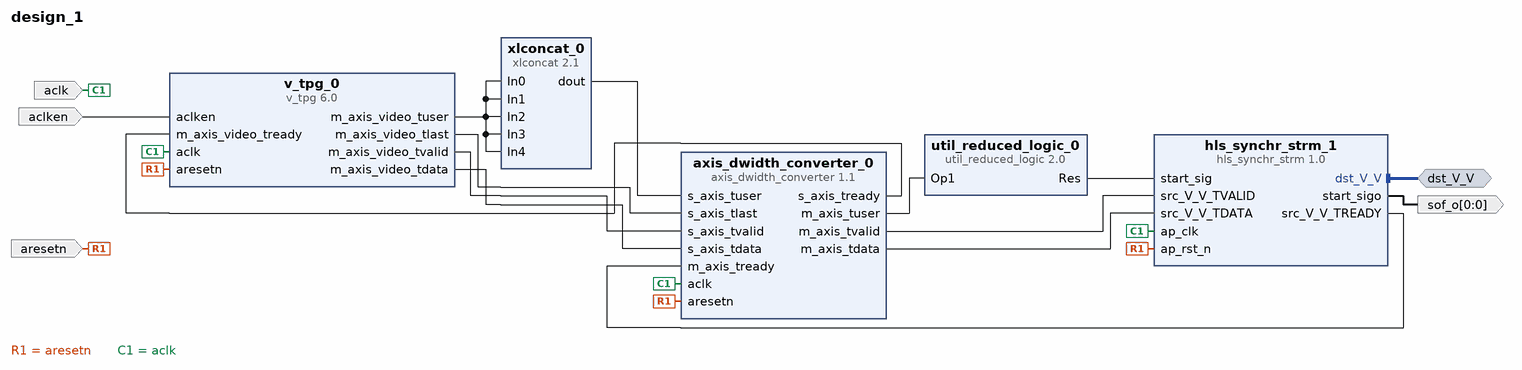
[diagram p0: block diagram of the top level]
# Vivado block design design_1, Vivado 2014.4
create_bd_design design_1

create_bd_intf_port -mode Master -vlnv xilinx.com:interface:axis_rtl:1.0 dst_V_V
set_property -dict {CONFIG.FREQ_HZ 19200000} [get_bd_intf_ports dst_V_V]
create_bd_port -dir I -type rst aresetn
create_bd_port -dir I -type ce aclken
create_bd_port -dir I -type clk aclk
set_property -dict {CONFIG.FREQ_HZ 19200000} [get_bd_ports aclk]
create_bd_port -dir O -from 0 -to 0 -type data sof_o

create_bd_cell -type ip -vlnv xilinx.com:ip:v_tpg:6.0 v_tpg_0
set_property -dict [list \
  CONFIG.has_axi4_lite false \
  CONFIG.data_width 12 \
  CONFIG.pattern_control 15 \
  CONFIG.active_cols 64 \
  CONFIG.active_rows 768 \
  CONFIG.m_video_format 2 \
] [get_bd_cells v_tpg_0]
create_bd_cell -type ip -vlnv xilinx.com:ip:xlconcat:2.1 xlconcat_0
set_property -dict {CONFIG.NUM_PORTS 5} [get_bd_cells xlconcat_0]
create_bd_cell -type ip -vlnv xilinx.com:ip:util_reduced_logic:2.0 util_reduced_logic_0
set_property -dict {CONFIG.C_SIZE 8} [get_bd_cells util_reduced_logic_0]
create_bd_cell -type ip -vlnv xilinx.com:ip:axis_dwidth_converter:1.1 axis_dwidth_converter_0
set_property -dict [list \
  CONFIG.S_TDATA_NUM_BYTES 5 \
  CONFIG.M_TDATA_NUM_BYTES 8 \
  CONFIG.TUSER_BITS_PER_BYTE 1 \
  CONFIG.HAS_TLAST 1 \
  CONFIG.HAS_MI_TKEEP 1 \
] [get_bd_cells axis_dwidth_converter_0]
create_bd_cell -type ip -vlnv xilinx.com:hls:hls_synchr_strm:1.0 hls_synchr_strm_1

# ---- connections ----

connect_bd_intf_net [get_bd_intf_ports dst_V_V] [get_bd_intf_pins hls_synchr_strm_1/dst_V_V]
connect_bd_net [get_bd_ports aresetn] \
  [get_bd_pins v_tpg_0/aresetn] [get_bd_pins axis_dwidth_converter_0/aresetn] [get_bd_pins hls_synchr_strm_1/ap_rst_n]
connect_bd_net [get_bd_ports aclken] [get_bd_pins v_tpg_0/aclken]
connect_bd_net [get_bd_ports aclk] [get_bd_pins v_tpg_0/aclk] [get_bd_pins hls_synchr_strm_1/ap_clk] [get_bd_pins axis_dwidth_converter_0/aclk]
connect_bd_net [get_bd_pins v_tpg_0/m_axis_video_tuser] \
  [get_bd_pins xlconcat_0/In0] [get_bd_pins xlconcat_0/In1] [get_bd_pins xlconcat_0/In2] [get_bd_pins xlconcat_0/In3] \
  [get_bd_pins xlconcat_0/In4]
connect_bd_net [get_bd_pins v_tpg_0/m_axis_video_tlast] [get_bd_pins axis_dwidth_converter_0/s_axis_tlast]
connect_bd_net [get_bd_pins xlconcat_0/dout] [get_bd_pins axis_dwidth_converter_0/s_axis_tuser]
connect_bd_net [get_bd_pins v_tpg_0/m_axis_video_tvalid] [get_bd_pins axis_dwidth_converter_0/s_axis_tvalid]
connect_bd_net [get_bd_pins v_tpg_0/m_axis_video_tdata] [get_bd_pins axis_dwidth_converter_0/s_axis_tdata]
connect_bd_net [get_bd_pins axis_dwidth_converter_0/s_axis_tready] [get_bd_pins v_tpg_0/m_axis_video_tready]
connect_bd_net [get_bd_pins axis_dwidth_converter_0/m_axis_tvalid] [get_bd_pins hls_synchr_strm_1/src_V_V_TVALID]
connect_bd_net [get_bd_pins hls_synchr_strm_1/src_V_V_TREADY] [get_bd_pins axis_dwidth_converter_0/m_axis_tready]
connect_bd_net [get_bd_pins axis_dwidth_converter_0/m_axis_tdata] [get_bd_pins hls_synchr_strm_1/src_V_V_TDATA]
connect_bd_net [get_bd_pins axis_dwidth_converter_0/m_axis_tuser] [get_bd_pins util_reduced_logic_0/Op1]
connect_bd_net [get_bd_pins util_reduced_logic_0/Res] [get_bd_pins hls_synchr_strm_1/start_sig]
connect_bd_net [get_bd_pins hls_synchr_strm_1/start_sigo] [get_bd_ports sof_o]

validate_bd_design
save_bd_design
